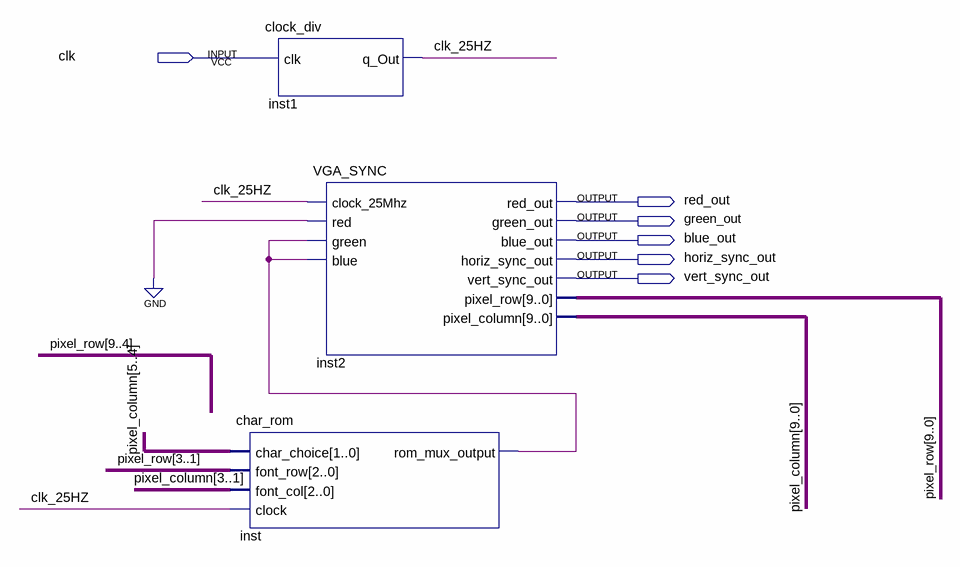
[diagram p0: schematic sheet]
// Quartus schematic TextExample.bdf as structural Verilog: 3 symbols, 6 pins
module TextExample (
  input  clk,
  output red_out,
  output green_out,
  output blue_out,
  output horiz_sync_out,
  output vert_sync_out
);

  wire clk_25HZ, inst_rom_mux_output;
  wire [9:0] pixel_column, pixel_row;

  char_rom inst (
    .char_choice(pixel_column[5:4]), .font_row(pixel_row[3:1]), .font_col(pixel_column[3:1]),
    .clock(clk_25HZ), .rom_mux_output(inst_rom_mux_output));
  clock_div inst1 (.clk(clk), .q_Out(clk_25HZ));
  VGA_SYNC inst2 (
    .clock_25Mhz(clk_25HZ), .red(1'b0), .green(inst_rom_mux_output), .blue(inst_rom_mux_output),
    .red_out(red_out), .green_out(green_out), .blue_out(blue_out), .horiz_sync_out(horiz_sync_out),
    .vert_sync_out(vert_sync_out), .pixel_row(pixel_row), .pixel_column(pixel_column));
endmodule
